# Altium schematic sheet MEMORY.SchDoc
size 420 x 297 mm; SheetNumber: 12; SheetTotal: 32; DocumentTypeShort: Э3; DocumentInvertoryNumber: ㅤ
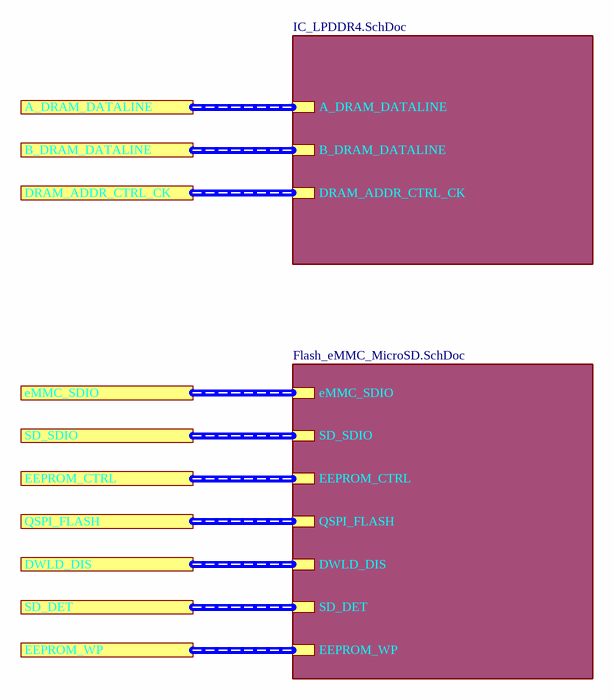
[diagram p0: MEMORY.SchDoc]

## Sub-sheets
Flash_eMMC_MicroSD = Flash_eMMC_MicroSD.SchDoc: eMMC_SDIO (harness eMMC_SDIO), SD_SDIO (harness SD_SDIO), EEPROM_CTRL (harness EEPROM_CTRL), DWLD_DIS (harness DWLD_DIS), SD_DET (harness SD_DET), QSPI_FLASH (harness QSPI_FLASH), EEPROM_WP (harness EEPROM_WP)
IC_LPDDR4 = IC_LPDDR4.SchDoc: A_DRAM_DATALINE (harness A_DRAM_DATALINE), B_DRAM_DATALINE (harness B_DRAM_DATALINE), DRAM_ADDR_CTRL_CK (harness DRAM_ADDR_CTRL_CK)

## Ports
A_DRAM_DATALINE, B_DRAM_DATALINE, DRAM_ADDR_CTRL_CK, DWLD_DIS, EEPROM_CTRL, EEPROM_WP, eMMC_SDIO, QSPI_FLASH, SD_DET, SD_SDIO

## Buses and harness runs
harness port A_DRAM_DATALINE = sheet IC_LPDDR4/A_DRAM_DATALINE
harness port B_DRAM_DATALINE = sheet IC_LPDDR4/B_DRAM_DATALINE
harness port DRAM_ADDR_CTRL_CK = sheet IC_LPDDR4/DRAM_ADDR_CTRL_CK
harness port DWLD_DIS = sheet Flash_eMMC_MicroSD/DWLD_DIS
harness port EEPROM_CTRL = sheet Flash_eMMC_MicroSD/EEPROM_CTRL
harness port EEPROM_WP = sheet Flash_eMMC_MicroSD/EEPROM_WP
harness port eMMC_SDIO = sheet Flash_eMMC_MicroSD/eMMC_SDIO
harness port QSPI_FLASH = sheet Flash_eMMC_MicroSD/QSPI_FLASH
harness port SD_DET = sheet Flash_eMMC_MicroSD/SD_DET
harness port SD_SDIO = sheet Flash_eMMC_MicroSD/SD_SDIO

## Notes on the sheet
- Подп. и дата
- Инв. № дубл.
- Взам. инв. №
- Инв. № подл.
- Изм.
- Лист
- № докум.
- Подп.
- Дата
- Копировал
- Формат А3